# EasyEDA Pro project ProProject_Quantum Mega_v0.2_2024-08-26.epro, schematic Main
Board Name: MainBoard; Create Date: 2024-04-19; Page Name: P1; Project Name: Quantum Mega; Schematic Name: Main; Update Date: 2024-08-20; Company: EasyEDA.com; Drawn: EasyEDA; Page Size: A4; Part Number: JLCPCB-002; Reviewed: EasyEDA; Version: V0.1
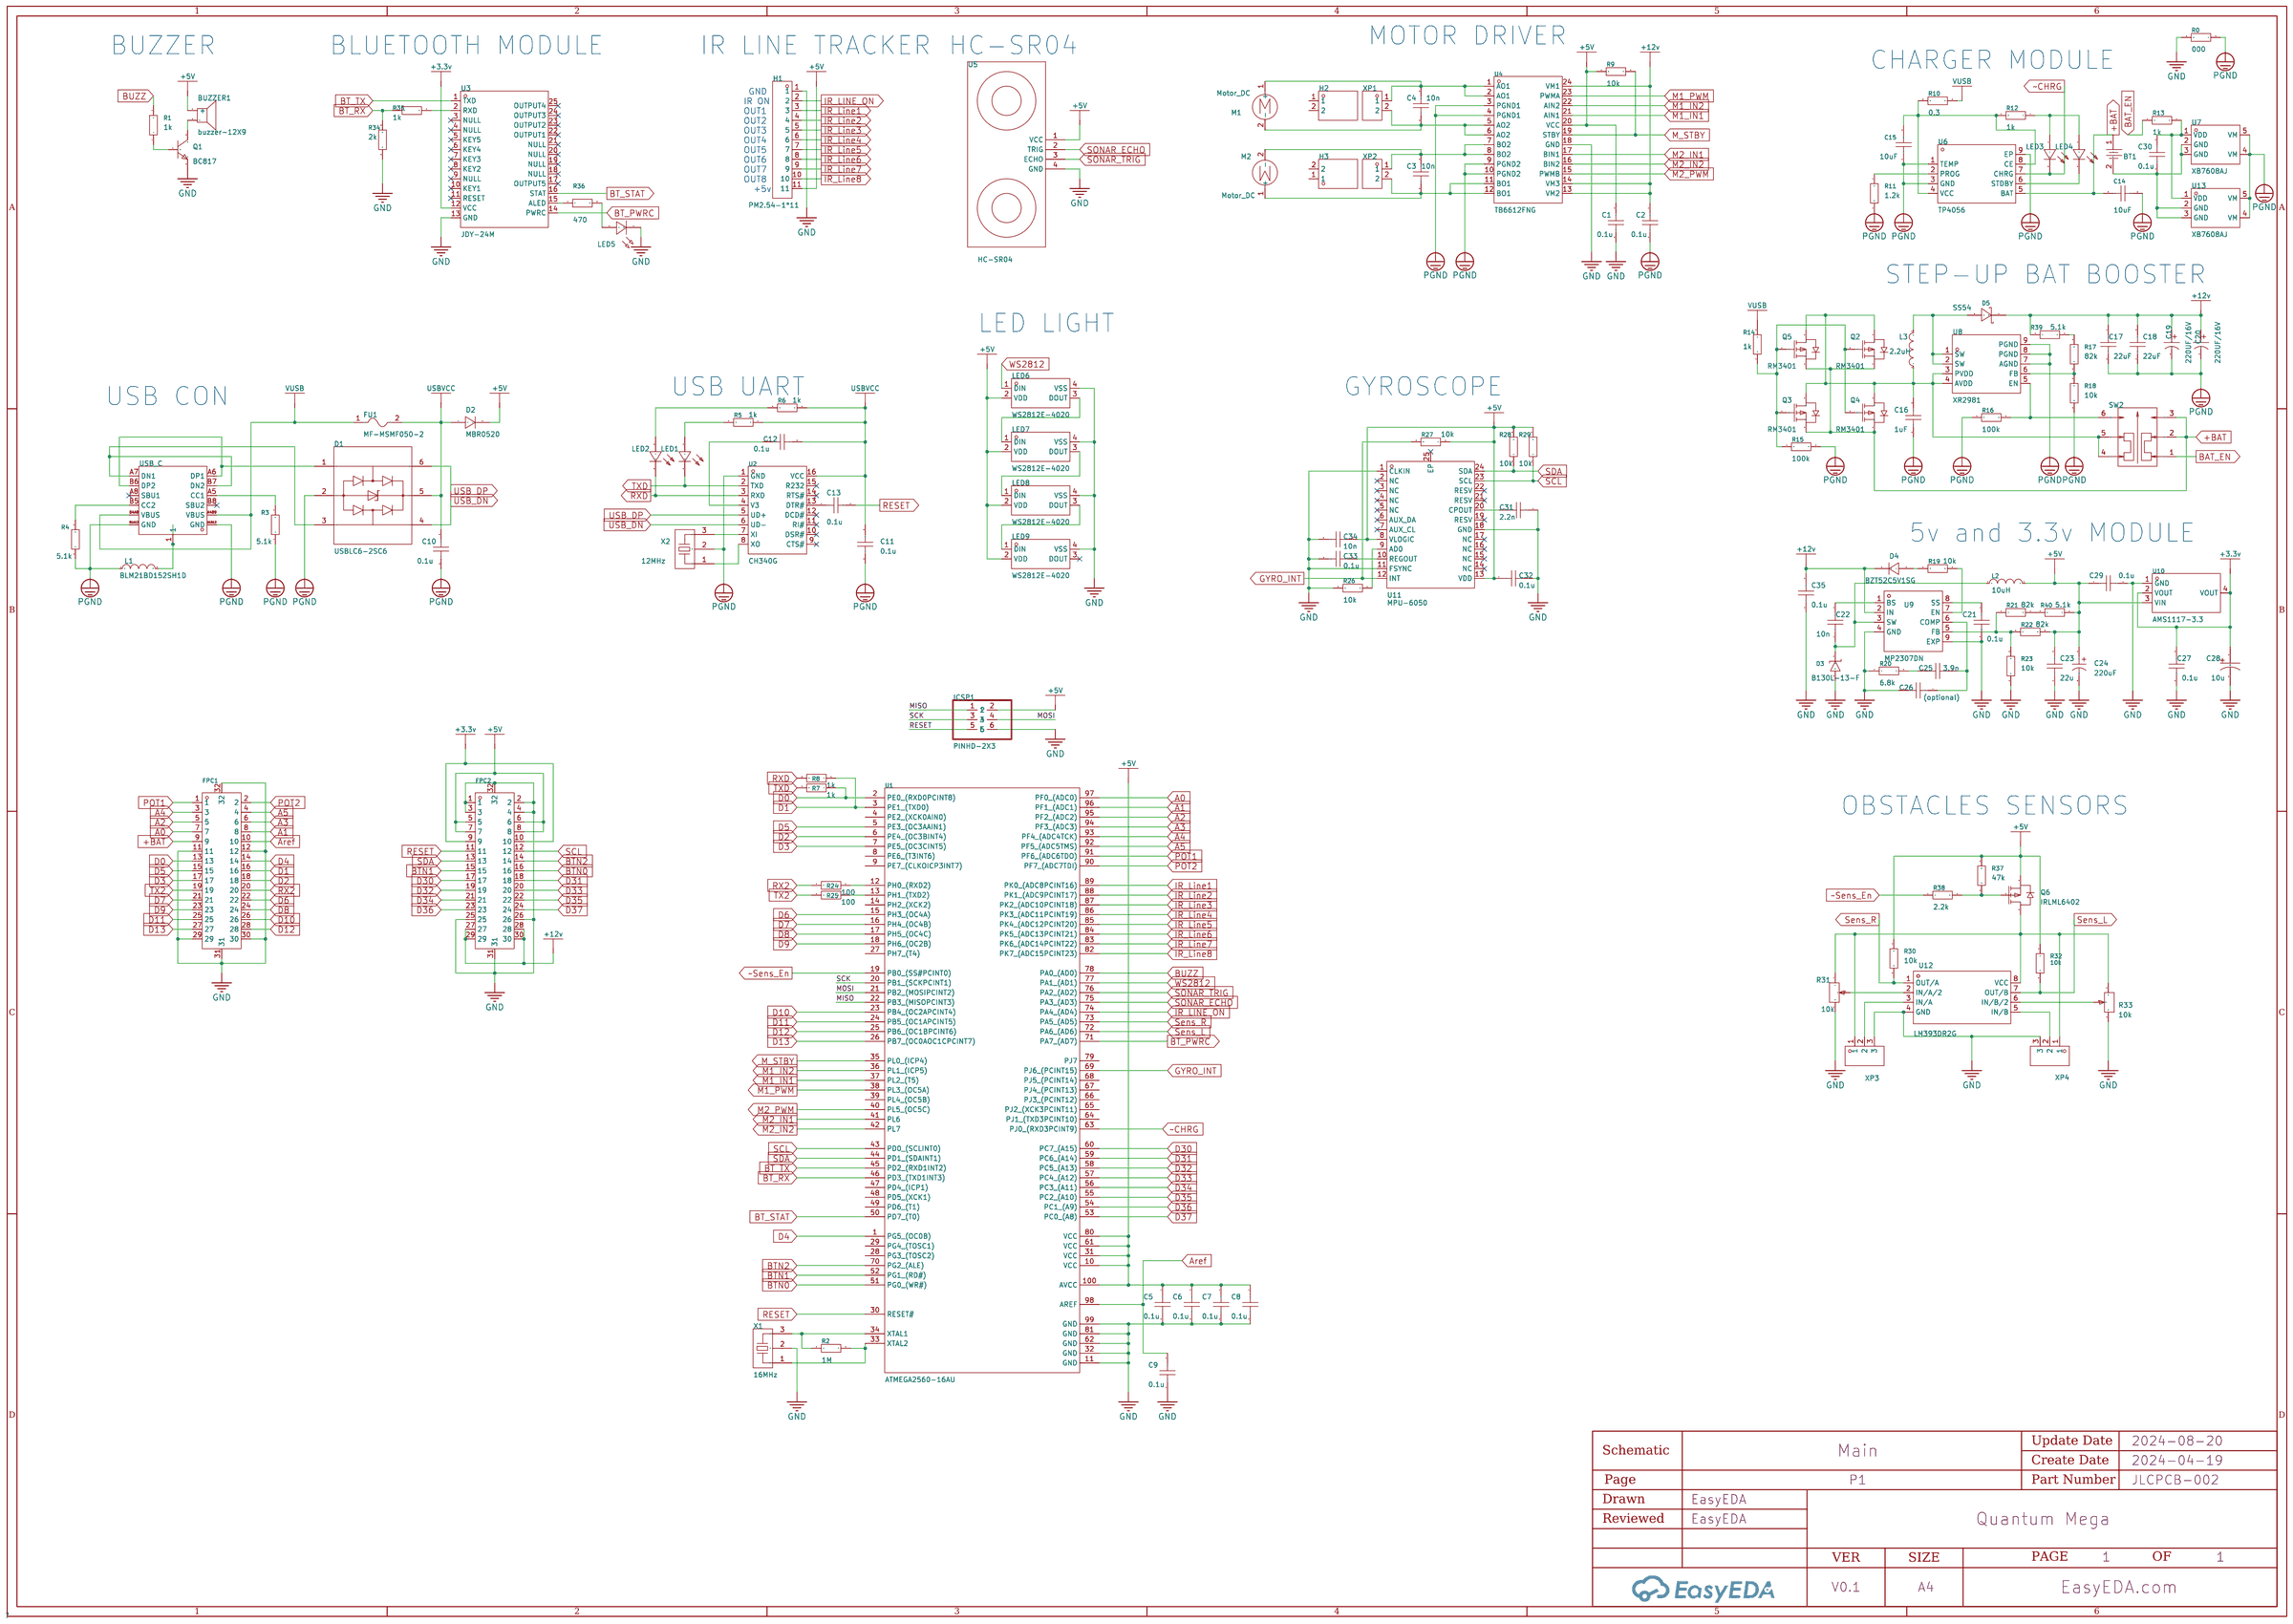
[diagram p0: schematic sheet]

## Parts
BT1  BH-18650-A5BJ001  [BAT-TH_18650-A5BJ001]
BUZZER1  buzzer-12X9  [BUZ-TH_BD12.0-P7.60-D0.6-FD]
C1  0.1u  [C0805]
C2  0.1u  [C0805]
C3  10n  [R0805]
C4  10n  [R0805]
C5  0.1u  [C0805]
C6  0.1u  [C0805]
C7  0.1u  [C0805]
C8  0.1u  [C0805]
C9  0.1u  [C0805]
C10  0.1u  [C0805]
C11  0.1u  [C0805]
C12  0.1u  [C0805]
C13  0.1u  [C0805]
C14  10uF  [C1210]
C15  10uF  [C1210]
C16  1uF  [C0805]
C17  22uF  [C1812]
C18  22uF  [C1812]
C19  220UF/16V  [CAP-SMD_BD6.3-L6.6-W6.6-LS7.2-FD]
C20  220UF/16V  [CAP-SMD_BD6.3-L6.6-W6.6-LS7.2-FD]
C21  0.1u  [C0805]
C22  10n  [C0805]
C23  22u  [C1812]
C24  220uF  [CAP-SMD_BD6.3-L6.6-W6.6-LS7.2-FD]
C25  3.9n  [C0805]
C26  (optional)  [C0805]
C27  0.1u  [C0805]
C28  10u  [CAP-SMD_BD4.0-L4.3-W4.3-LS5.3-FD]
C29  0.1u  [C0805]
C30  0.1u  [C0805]
C31  2.2n  [C0805]
C32  0.1u  [C0805]
C33  0.1u  [C0805]
C34  10n  [C0805]
C35  0.1u  [C0805]
D1  USBLC6-2SC6  [SOT-23-6_L2.9-W1.6-P0.95-LS2.8-BL]
D2  MBR0520  [SOD-123_L2.7-W1.6-LS3.7-FD]
D3  B130L-13-F  [SMA_L4.4-W2.6-LS5.0-RD]
D4  BZT52C5V1SG  [SOD-323_L1.7-W1.3-LS2.7-RD]
D5  SS54  [SMC_L6.9-W5.9-LS7.9-RD]
FPC1  FFC05012-30SSA124W5M  [FPC-SMD_FFC05012-30SSA124W5M]
FPC2  FFC05012-30SSA124W5M  [FPC-SMD_FFC05012-30SSA124W5M]
FU1  MF-MSMF050-2  [F1812]
H1  PM2.54-1*11  [HDR-TH_11P-P2.54-V-F]
H2  A2541HWR-2P  [HDR-TH_2P-P2.54-H-W8.7_A2541HWR-2P]
H3  A2541HWR-2P  [HDR-TH_2P-P2.54-H-W8.7_A2541HWR-2P]
ICSP1  3x2M  [2X03]
L1  BLM21BD152SH1D  [L0805]
L2  10uH  [IND-SMD_L7.2-W6.6_GPSR07X0]
L3  2.2uH  [IND-SMD_L10.5-W10.0]
LED1  Tx  [LED0805-R-RD_GREEN]
LED2  Rx  [LED0805-R-RD_GREEN]
LED3  CHRG  [LED0805-R-RD_GREEN]
LED4  STBY  [LED0805-R-RD_GREEN]
LED5  BT  [LED0805-RD_GREEN]
LED6  WS2812E-4020  [LED-SMD_4P-L4.0-W1.7-R]
LED7  WS2812E-4020  [LED-SMD_4P-L4.0-W1.7-R]
LED8  WS2812E-4020  [LED-SMD_4P-L4.0-W1.7-R]
LED9  WS2812E-4020  [LED-SMD_4P-L4.0-W1.7-R]
M1  Motor_DC  [N20_DC_MOTOR 3D]
M2  Motor_DC  [N20_DC_MOTOR 3D]
Q1  BC817  [SOT-23(SOT-23-3)]
Q2  RM3401  [SOT-23-3_L2.9-W1.3-P1.90-LS2.8-BR]
Q3  RM3401  [SOT-23-3_L2.9-W1.3-P1.90-LS2.8-BR]
Q4  RM3401  [SOT-23-3_L2.9-W1.3-P1.90-LS2.8-BR]
Q5  RM3401  [SOT-23-3_L2.9-W1.3-P1.90-LS2.8-BR]
Q6  IRLML6402  [SOT-23-3_L2.9-W1.3-P1.90-LS2.4-BR]
R0  000  [R0805]
R1  1k  [R0805]
R2  1M  [R0805]
R3  5.1k  [R0805]
R4  5.1k  [R0805]
R5  1k  [R0805]
R6  1k  [R0805]
R7  1k  [R0805]
R8  1k  [R0805]
R9  10k  [R0805]
R10  0.3  [R0805]
R11  1.2k  [R0805]
R12  1k  [R0805]
R13  1k  [R0805]
R14  1k  [R0805]
R15  100k  [R0805]
R16  100k  [R0805]
R17  82k  [R0805]
R18  10k  [R0805]
R19  10k  [R0805]
R20  6.8k  [R0805]
R21  82k  [R0805]
R22  82k  [R0805]
R23  10k  [R0805]
R24  100  [R0805]
R25  100  [R0805]
R26  10k  [R0805]
R27  10k  [R0805]
R28  10k  [R0805]
R29  10k  [R0805]
R30  10k  [R0805]
R31  10k  [RES-ADJ-SMD_RM065-V1]
R32  10k  [R0805]
R33  10k  [RES-ADJ-SMD_RM065-V1]
R34  2k  [R0805]
R35  1k  [R0805]
R36  470  [R0805]
R37  47k  [R0805]
R38  2.2k  [R0805]
R39  5.1k  [R0805]
R40  5.1k  [R0805]
SW2  PWR  [SW-SMD_NIDEC_CL-SB-22B-XX]
U1  ATMEGA2560-16AU  [TQFP-100_L14.0-W14.0-P0.50-LS16.0-BL]
U2  CH340G  [SOIC-16_L9.9-W3.9-P1.27-LS6.0-BL]
U3  JDY-24M  [BULETM-SMD_JDY-24M]
U4  TB6612FNG  [SSOP-24_L8.4-W5.8-P0.65-LS7.8-BL]
U5  HC-SR04  [ULTRASONIC-HC-SR04#V]
U6  TP4056  [ESOP-8_L4.9-W3.9-P1.27-LS6.0-BL-EP]
U7  XB7608AJ  [CPC-5_L2.6-W2.6-P0.53-LS4.0-BL]
U8  XR2981  [SO-8_L4.9-W3.9-P1.27-LS6.0-BL-EP]
U9  MP2307DN  [SOP-8_L4.9-W3.9-P1.27-LS6.0-BL-EP]
U10  AMS1117-3.3  [SOT-223-3_L6.5-W3.4-P2.30-LS7.0-BR]
U11  MPU-6050  [QFN-24_L4.0-W4.0-P0.50-BL-EP2.7]
U12  LM393DR2G  [SOIC-8_L5.0-W4.0-P1.27-LS6.0-BL]
U13  XB7608AJ  [CPC-5_L2.6-W2.6-P0.53-LS4.0-BL]
USB_C  USB-C-SMD-DIP_TYPEC-缩减引脚  [USB-C-SMD_C9900005364]
X1  16MHz  [OSC-SMD_3P-L3.2-W1.3-P0.95-L]
X2  12MHz  [CRYSTAL-SMD_3P-L3.2-W1.3-P1.2-L]
XP1  2.54-1*2  [HDR-TH_2P-P2.54-V-M]
XP2  2.54-1*2  [HDR-TH_2P-P2.54-V-M]
XP3  D32  [HDR-TH_3P-P2.54-V-M]
XP4  D32  [HDR-TH_3P-P2.54-V-M]

## Library data of the parts
BT1 = BH-18650-A5BJ001: Supplier Part: C5383220; Manufacturer: MYOUNG(美阳); Supplier Footprint: 插件; JLCPCB Part Class: Extended Part; Datasheet: https://atta.szlcsc.com/upload/public/pdf/source/20230321/F45C04DF2D4E00D187312CBE97BD9F67.pdf; Supplier: LCSC
BUZZER1 = BUZZER-12X9: Supplier Part: C9900016920; Supplier Footprint: BUZZER_SMT_9650B; Datasheet: https://atta.szlcsc.comnull; Supplier: LCSC
C1-C13 C16 C17 C21 C22 C25-C27 C29-C35 = CAP_0805: Supplier Footprint: 0805
C14 C15 = 10uF(106) 50V: Capacitance: Tolerance:±20% Tolerance:±20% Voltage Rated: Temperature Coefficient:; LCSC Part Name: 10uF ±20% 50V; Supplier Part: C18791; Manufacturer: SAMSUNG(三星); Supplier Footprint: 1210; Datasheet: https://atta.szlcsc.com/upload/public/pdf/source/20160218/1457707763339.pdf; Supplier: LCSC; Tolerance: ±20%
C18 C23 = C4532X7S2A475K230KB: Capacitance: Tolerance:±10% Tolerance:±10% Voltage Rated: Temperature Coefficient:; LCSC Part Name: 4.7uF ±10% 100V; Supplier Part: C5343513; Manufacturer: TDK; Supplier Footprint: 1812; Datasheet: https://atta.szlcsc.com/upload/public/pdf/source/20221215/52D81A5CA808B00E15B0062CF01F9008.pdf; Supplier: LCSC; Tolerance: ±10%
C19 C20 = 220UF/16V: Supplier Part: C9900025507; Supplier: LCSC
C24 = RVT220UF6.3V67RV0014: Capacitance: Tolerance:±20% Tolerance:±20% Rated Voltage: Ripple Current:69mA@120Hz Equivalent Series Resistance(ESR):- φD: L: Lifetime @ Temp:2000hrs@105℃ Operating Temperature:-55℃~+105℃ Operating Temperature:-55℃~+105℃; LCSC Part Name: 220uF ±20% 6.3V; Supplier Part: C2895278; Manufacturer: KNSCHA(科尼盛); Supplier Footprint: SMD,D6.3xL5.4mm; JLCPCB Part Class: Extended Part; Datasheet: https://atta.szlcsc.com/upload/public/pdf/source/20210913/890E4661012CCEBB9DDD97A723250D28.pdf; Supplier: LCSC; Tolerance: ±20%; Ripple Current: 69mA@120Hz; Lifetime @ Temp: 2000hrs@105℃; Operating Temperature: -55℃~+105℃
C28 = CAP-SMD 4*5 10uF ±10% 16V: Supplier Part: C9900020910; Supplier: LCSC
D1 = USBLC6-2SC6: Reverse Stand-Off Voltage (Vrwm):5V Maximum Clamping Voltage:20V Peak Pulse Current (Ipp)@10/1000us:5A Breakdown Voltage:6V Type:ESD; LCSC Part Name: ESD二极管 USBLC6-2SC6; Supplier Part: C323793; Supplier Footprint: SOT-23-6; JLCPCB Part Class: Extended Part; Datasheet: https://atta.szlcsc.com/upload/public/pdf/source/20181029/C323793_48F7908330A3F84485333C8DC43F9E49.pdf; Supplier: LCSC; Reverse Stand-Off Voltage (Vrwm): 5V; Maximum Clamping Voltage: 20V; Peak Pulse Current (Ipp)@10/1000us: 5A; Breakdown Voltage: 6V; Type: ESD
D2 = MBR0520: Supplier Part: C9900003957; Supplier Footprint: SMD; Supplier: LCSC
D3 = B130L-13-F: Forward Voltage (Vf@If):410mV@1A Reverse Voltage (Vr):30V Average Rectified Current (Io):1A Reverse Leakage Current (Ir):1mA@30V; LCSC Part Name: 电压:30V 电流:1A; Supplier Part: C134425; Manufacturer: DIODES(美台); Supplier Footprint: SMA(DO-214AC); JLCPCB Part Class: Extended Part; Datasheet: https://atta.szlcsc.com/upload/public/pdf/source/20171023/C134425_15087453460171052520.pdf; Supplier: LCSC; Forward Voltage (Vf@If): 410mV@1A; Reverse Voltage (Vr): 30V; Average Rectified Current (Io): 1A; Reverse Leakage Current (Ir): 1mA@30V
D4 = BZT52C5V1SG: Diode Configuration:Single Zener Voltage (Nom):5.1V Reverse Leakage Current (Ir):2uA@2V Zener Voltage (Range):4.8V~5.4V Zener Voltage (Range):4.8V~5.4V Power Dissipation:200mW Zener Impedance (Zzt):60Ω Tolerance:- Tolerance:-; Supplier Part: C380915; Manufacturer: 银河微电子; Supplier Footprint: SOD-323; JLCPCB Part Class: Extended Part; Datasheet: https://atta.szlcsc.com/upload/public/pdf/source/20190329/C380915_020C618AABE0118D1D286643A4AEE66A.pdf; Supplier: LCSC; Diode Configuration: Single; Zener Voltage (Nom): 5.1V; Reverse Leakage Current (Ir): 2uA@2V; Zener Voltage (Range): 4.8V~5.4V; Power Dissipation: 200mW; Zener Impedance (Zzt): 60Ω
D5 = SS54_C5161913: Supplier Part: C5161913; Manufacturer: ZHIDE(志得); Supplier Footprint: SMC; Datasheet: https://atta.szlcsc.com/upload/public/pdf/source/20221010/22BE397587DAF4D48DAC802777F26F98.pdf; Supplier: LCSC
FPC1 FPC2 = FFC05012-30SSA124W5M: Locking Feature:抽屉式 Contact Type:单侧触点/Vertical Number of Contacts:30P Pitch:0.5mm Mounting Type:Brick nogging FFC, FCB Thickness:0.3mm FFC, FCB Thickness:0.3mm Height Above Board:- Operating Temperature Range:-40℃~+85℃ Operating Temperature Range:-40℃~+85; LCSC Part Name: 间距:0.5mm P数:30P 抽屉式 单侧触点/垂直; Supplier Part: C2834153; Manufacturer: TXGA(特思嘉); Supplier Footprint: SMD,P=0.5mm(交错脚); JLCPCB Part Class: Extended Part; Datasheet: https://atta.szlcsc.com/upload/public/pdf/source/20210517/C2834153_A4D413E3C8B5AC462050F50D944F5EA0.pdf; Supplier: LCSC; Locking Feature: 抽屉式; Contact Type: 单侧触点/Vertical; Number of Contacts: 30P; Pitch: 0.5mm; Mounting Type: Brick nogging; FFC, FCB Thickness: 0.3mm; Operating Temperature Range: -40℃~+85℃
FU1 = MF-MSMF050-2: Operating Voltage (Max):15V Current Rating (Max):100A Hold Current:500mA Trip Current:1A Resistance - Initial (Ri) (Min):150mΩ Resistance - Post Trip (R1) (Max):1Ω Maximum Time to Trip:150ms Operating Temperature:-40℃~+85℃ Operating Temperature:-40℃~+85℃; LCSC Part Name: 15V 500mA 1812自恢复; Supplier Part: C17313; Manufacturer: BOURNS; Supplier Footprint: 1812; JLCPCB Part Class: Extended Part; Datasheet: https://atta.szlcsc.com/upload/public/pdf/source/20161125/1480068354310.pdf; Supplier: LCSC; Operating Voltage (Max): 15V; Current Rating (Max): 100A; Hold Current: 500mA; Trip Current: 1A; Resistance - Initial (Ri) (Min): 150mΩ; Resistance - Post Trip (R1) (Max): 1Ω; Maximum Time to Trip: 150ms; Operating Temperature: -40℃~+85℃
H1 = PM2.54-1*11: Holes Structure:1x11P Pitch:2.54mm Number of Rows:Plugin Contact Plating:Gold; LCSC Part Name: 1x11P 间距:2.54mm; Supplier Part: C5371988; Manufacturer: ZHOURI(洲日); Supplier Footprint: 插件,P=2.54mm; JLCPCB Part Class: Extended Part; Supplier: LCSC; Holes Structure: 1x11P; Pitch: 2.54mm; Number of Rows: Plugin; Contact Plating: Gold
H2 H3 = A2541HWR-2P: Holes Structure:1x2P Pitch:2.54mm Row Spacing:- Circular Hole / Square Hole:方孔 Mounting Type:Right-Angle Number of Rows:Plugin Number of Holes:2P Current Rating (Max):3A Voltage Rating (Max):250V Holes Direction:side Insulation Height:2.5mm Contact Materi; LCSC Part Name: 1x2P 间距:2.54mm 弯插; Supplier Part: C225510; Manufacturer: CJT(长江连接器); Supplier Footprint: 弯插,P=2.54mm; JLCPCB Part Class: Extended Part; Datasheet: https://atta.szlcsc.com/upload/public/pdf/source/20180724/C239359_48B1BC0CA1B4E4396A63955AAFD15564.pdf; Supplier: LCSC; Holes Structure: 1x2P; Pitch: 2.54mm; Circular Hole / Square Hole: 方孔; Mounting Type: Right-Angle; Number of Rows: Plugin; Number of Holes: 2P; Current Rating (Max): 3A; Voltage Rating (Max): 250V; Holes Direction: side; Insulation Height: 2.5mm; Contact Material: Brass; Contact Plating: Gold; Operating Temperature Range: -40℃~+105℃; PIN Length: 3.2mm
ICSP1 = Arduino_MEGA_2560-Rev3-eagle-import_PINHD-2X3
L1 = BLM21BD152SH1D: Impedance @ Frequency:1.5kΩ@100MHz Circuits:1; Supplier Part: C1235323; Manufacturer: muRata(村田); Supplier Footprint: 0805; JLCPCB Part Class: Extended Part; Supplier: LCSC; Impedance @ Frequency: 1.5kΩ@100MHz; Circuits: 1
L2 = CYA0630-10UH: Inductance: Tolerance:±20% Tolerance:±20% Rated Current: DC Resistance (DCR):; LCSC Part Name: 10uH ±20%; Supplier Part: C5189958; Manufacturer: SHOU HAN(首韩); Supplier Footprint: SMD,7.2x6.6mm; JLCPCB Part Class: Extended Part; Datasheet: https://atta.szlcsc.com/upload/public/pdf/source/20221010/B55E8796F05F85A38044F3826C14EFDD.pdf; Supplier: LCSC; Tolerance: ±20%
L3 = 2.2UH5A贴片电感: Supplier Part: C9900026809; Supplier Footprint: 2.2uH/5A; Supplier: LCSC
LED1-LED4 = LED_0805: Supplier Part: C9900014946; Supplier Footprint: LED0; Supplier: LCSC
LED5 = LED_0805-B: Supplier Footprint: 0805
LED6-LED9 = WS2812E-4020: Supplier Part: C5446701; Manufacturer: worldsemi; Supplier Footprint: SMD4020; JLCPCB Part Class: Extended Part; Datasheet: https://atta.szlcsc.com/upload/public/pdf/source/20230802/C0729ADAC2FEACDF29850CD4568798F9.pdf; Supplier: LCSC
M1 M2 = Motor_DC: license: https://www.gnu.org/licenses/lgpl-2.1.html
Q1 = BC817: link: https://item.szlcsc.com/9070.html; 3DModel: SOT-23-3P_L2.9-W1.3-H1.0-LS2.4-P0.95; Supplier: LCSC; Manufacturer: CJ; image: //image.lceda.cn/szlcsc/C8589.jpg; Supplier Part: C8589; JLCPCB Part Class: Extended Part
Q2-Q5 = RM3401: Type:1个PChannel Drain Source Voltage (Vdss): Continuous Drain Current (Id): Power Dissipation (Pd): Drain Source On Resistance (RDS(on)@Vgs,Id): Gate Threshold Voltage (Vgs(th)@Id):1.3V@250uA Input Capacitance (Ciss@Vds):880pF@15V Operating Temperature:-5; LCSC Part Name: 1个P沟道 耐压:30V 电流:4.2A; Supplier Part: C3289980; Manufacturer: RECTRON(丽正); Supplier Footprint: SOT-23; Datasheet: https://atta.szlcsc.com/upload/public/pdf/source/20240403/615A0FF49014754CF5DAE5883E8BCBFD.pdf; Supplier: LCSC; Type: 1个PChannel; Gate Threshold Voltage (Vgs(th)@Id): 1.3V@250uA; Input Capacitance (Ciss@Vds): 880pF@15V; Operating Temperature: -55℃~+150℃@(Tj)
Q6 = IRLML6402: LCSC Part Name: MOS管; Supplier Part: C2959853; Manufacturer: TECH PUBLIC(台舟); Supplier Footprint: SOT-23; JLCPCB Part Class: Extended Part; Datasheet: https://atta.szlcsc.com/upload/public/pdf/source/20220120/03536D8328DEC2090766B19669562DF5.pdf; Supplier: LCSC
R0-R30 R32 R34-R40 = 0805 resistor: LCSC Part Name: 12kΩ ±1% 125mW 厚膜电阻; Supplier Part: C17444; Manufacturer: UNI-ROYAL(厚声); Manufacturer Part: 0805W8F1202T5E; Supplier Footprint: 0805; JLCPCB Part Class: Basic Part; Datasheet: https://atta.szlcsc.com/upload/public/pdf/source/20200306/C422600_1E6D84923E4A46A82E41ADD87F860B5C.pdf; Supplier: LCSC; Tolerance: ±1%; Temperature Coefficient: ±100ppm/℃; Type: Thick Film Resistors; Operating Temperature Range: -55℃~+155℃
R31 R33 = RM065-501(500R): Resistance: Tolerance:±25% Tolerance:±25% Power(Watts):; LCSC Part Name: 500Ω ±25%; Supplier Part: C5205017; Manufacturer: BOCHEN(博晨); Supplier Footprint: 插件; JLCPCB Part Class: Extended Part; Datasheet: https://atta.szlcsc.com/upload/public/pdf/source/20221019/6263C46FBC7F1B66CBAADA74DC5EFAA2.pdf; Supplier: LCSC; Tolerance: ±25%
SW2 = CL-SB-22B-02: Circuit:DPDT Actuator Style:Rectangular columnar Pin Style:Gull Wing Mounting Style:Brick nogging Voltage Rating (DC):12V Operating Temperature:-40℃~+85℃ Operating Temperature:-40℃~+85℃; Supplier Part: C5573311; Manufacturer: NIDEC(尼得科); Datasheet: https://atta.szlcsc.com/upload/public/pdf/source/231023/cl-sb.pdf-55b3417ad2bcaca9f3ae11e732aa5559.pdf; Supplier: LCSC; Circuit: DPDT; Actuator Style: Rectangular columnar; Pin Style: Gull Wing; Mounting Style: Brick nogging; Voltage Rating (DC): 12V; Operating Temperature: -40℃~+85℃
U1 = ATMEGA2560-16AU: CPU Core:AVR Program Storage Size:256KB RAM Size:8KB GPIO Ports Number:86 Operating Voltage Range:4.5V~5.5V Operating Voltage Range:4.5V~5.5V CPU Maximum Speed:16MHz Program Memory Type:FLASH EEPROM:4KB Operating Temperature Range:-40℃~+85℃ Operating Temp; LCSC Part Name: ATMEGA2560-16AU MSL=3; Supplier Part: C22460; Manufacturer: MICROCHIP(美国微芯); Supplier Footprint: TQFP-100(14x14); JLCPCB Part Class: Extended Part; Datasheet: https://atta.szlcsc.com/upload/public/pdf/source/20180629/C184061_12C3FF49A7078B074E4E6578B2EA6640.pdf; Supplier: LCSC; CPU Core: AVR; Program Storage Size: 256KB; RAM Size: 8KB; GPIO Ports Number: 86; Operating Voltage Range: 4.5V~5.5V; CPU Maximum Speed: 16MHz; Program Memory Type: FLASH; EEPROM: 4KB; Operating Temperature Range: -40℃~+85℃; ADC (Bit): 10bit; Peripheral/Function: WDT；PWM; Watchdog: 有; Low-Voltage Detect: 有; Internal Oscillator: 有
U2 = CH340G: Applications Function:Transceiver Protocol: Supply Voltage:3.3V；5V Supply Voltage:3.3V；5V Data Rate:2Mbps; LCSC Part Name: USB转串口芯片 CH340; Supplier Part: C14267; Manufacturer: WCH(南京沁恒); Supplier Footprint: SOP-16; JLCPCB Part Class: Extended Part; Datasheet: https://atta.szlcsc.com/upload/public/pdf/source/20230530/6E401E9554E9F5311886CC8B3F89B62E.pdf; Supplier: LCSC; Applications Function: Transceiver; Supply Voltage: 3.3V；5V; Data Rate: 2Mbps
U3 = JDY-24M: Supplier Part: C9900004473; Supplier Footprint: SMD; JLCPCB Part Class: Extended Part; Supplier: LCSC
U4 = TB6612FNG(O,C,8,EL: Supplier Part: C88224; Manufacturer: TOSHIBA(东芝); Supplier Footprint: SSOP-24-208mil; JLCPCB Part Class: Extended Part; Datasheet: https://atta.szlcsc.com/upload/public/pdf/source/20171128/C141517_15118625624231147036.pdf; Supplier: LCSC
U5 = ULTRASONIC-HC-SR04_#V
U6 = TP4056: Supplier Part: C9900002169; Supplier Footprint: ESOP-8; Supplier: LCSC
U7 U13 = XB7608AJ: Supplier Part: C2681921; Manufacturer: xysemi(赛芯微); Supplier Footprint: CPC-5; JLCPCB Part Class: Extended Part; Datasheet: https://atta.szlcsc.com/upload/public/pdf/source/20201230/C2681921_63F43FD1A79E48A5DEB3B0D5E2CF4C87.pdf; Supplier: LCSC
U8 = XR2981: Supplier Part: C2687446; Supplier Footprint: MSOP-8-EP(3.9x4.9x1.27); JLCPCB Part Class: Extended Part; Supplier: LCSC
U9 = MP2307DN-LF-Z: Function:Step-down type Output Type:Adjustable Input Voltage:4.75V~23V Input Voltage:4.75V~23V Output Voltage:0.925V~20V Output Voltage:0.925V~20V Output Current (Max):3A Switching Frequency:340kHz Operating Temperature:-40℃~+85℃@(TA) Operating Temperatur; Supplier Part: C18921; Supplier Footprint: SOP-8-EP-150mil; JLCPCB Part Class: Extended Part; Supplier: LCSC; Function: Step-down type; Output Type: Adjustable; Input Voltage: 4.75V~23V; Output Voltage: 0.925V~20V; Output Current (Max): 3A; Switching Frequency: 340kHz; Operating Temperature: -40℃~+85℃@(TA); Synchronous Rectification: Yes; Number of Outputs: 1; Topology: Step-down; Switch tube (built-in/external): 内置
U10 = AMS1117-3.3_C6186: Output Type: Maximum Input Voltage:- Output Voltage:3.3V Output Voltage:3.3V MAX Output Current:1A Power Supply Rejection Ratio (PSRR):72dB@(120Hz) Dropout Voltage:1.3V@(800mA) standby current:- Noise:- Feature:- Operating Temperature:- Operating Temperat; LCSC Part Name: 输出3.3V 1A; Supplier Part: C6186; Manufacturer: AMS; Supplier Footprint: SOT-223-3; JLCPCB Part Class: Basic Part; Datasheet: https://atta.szlcsc.com/upload/public/pdf/source/20180727/C6186_7A095716F0823C02F1997A905E26C086.pdf; Supplier: LCSC; Output Voltage: 3.3V; MAX Output Current: 1A; Power Supply Rejection Ratio (PSRR): 72dB@(120Hz); Dropout Voltage: 1.3V@(800mA); Output Polarity: Positive electrode; Number of Outputs: 1
U11 = MPU-6050: Sensor Type:加速度计陀螺仪 Operating Temperature:-40℃~+85℃ Operating Temperature:-40℃~+85℃; Supplier Part: C24112; Manufacturer: TDK InvenSense(应美盛); Supplier Footprint: QFN-24-EP(4x4); JLCPCB Part Class: Extended Part; Datasheet: https://atta.szlcsc.com/upload/public/pdf/source/20140425/1457707046159.pdf; Supplier: LCSC; Sensor Type: 加速度计陀螺仪; Operating Temperature: -40℃~+85℃
U12 = LM393DR2G: Input Offset Voltage (Vos):5mV Input Bias Current (Ib):250nA Input Hysteresis Voltage (Vhys):- Common Mode Rejection Ratio (CMRR):- Supply Voltage:1V~18V；2V~36V Supply Voltage:1V~18V；2V~36V Output Type:开集 Output Mode:- Supply Current:2.5mA Operating Tempe; LCSC Part Name: 比较器，双，低偏移电压; Supplier Part: C7955; Manufacturer: onsemi(安森美); Supplier Footprint: SOIC-8; JLCPCB Part Class: Basic Part; Datasheet: https://atta.szlcsc.com/upload/public/pdf/source/20140815/1457707223499.pdf; Supplier: LCSC; Input Offset Voltage (Vos): 5mV; Input Bias Current (Ib): 250nA; Supply Voltage: 1V~18V；2V~36V; Output Type: 开集; Supply Current: 2.5mA; Operating Temperature: 0℃~+70℃
USB_C = USB-C-SMD-DIP_TYPEC-缩减引脚: Supplier Part: C9900005364; Supplier Footprint: USB-C-SMD-DIP; Supplier: LCSC
X1 = CSTCE16M0V53-R0: Frequency: Built-in Load Capacitance: Resonant Impedance: Operating Temperature:-20℃~+80℃ Operating Temperature:-20℃~+80℃; LCSC Part Name: 16MHz ±0.5% 内置负载电容:15pF; Supplier Part: C32180; Manufacturer: muRata(村田); Supplier Footprint: SMD3213-3P; JLCPCB Part Class: Extended Part; Datasheet: https://atta.szlcsc.com/upload/public/pdf/source/20190918/C363966_9B0AD0E91EFDC171DB7BF0EEA53BA277.pdf; Supplier: LCSC; Operating Temperature: -20℃~+80℃
X2 = CSTCE12M0G52-R0: Frequency: Built-in Load Capacitance: Resonant Impedance:- Operating Temperature:-20℃~+80℃ Operating Temperature:-20℃~+80℃; LCSC Part Name: 12M ±0.5% 10pF 即将停产 即将停产; Supplier Part: C91580; Manufacturer: muRata(村田); Supplier Footprint: SMD3213-3P; Datasheet: https://atta.szlcsc.com/upload/public/pdf/source/20161226/1482720169997.pdf; Supplier: LCSC; Operating Temperature: -20℃~+80℃
XP1 XP2 = 2.54-1*2: Pin Structure:1x2P Pitch:2.54mm Number of Rows:Plugin Number of Pins:2P Contact Plating:Gold; LCSC Part Name: 停产; Supplier Part: C5116481; Manufacturer: ZHOURI(洲日); Supplier Footprint: 插件,P=2.54mm; JLCPCB Part Class: Extended Part; Datasheet: https://atta.szlcsc.com/upload/public/pdf/source/20220729/DF18AADA08AA3A4F1D3B0508BB8F7248.pdf; Supplier: LCSC; Pin Structure: 1x2P; Pitch: 2.54mm; Number of Rows: Plugin; Number of Pins: 2P; Contact Plating: Gold
XP3 XP4 = 5-146277-3: Pitch:2.54mm Circluar Pins/Square Pins:Square Pins Mounting Type:Straight Number of Rows:Plugin Number of Pins:3P Current Rating (Max):3A Voltage Rating (Max):- Length of Mating Pin:8.08mm Insulation Height:2.29mm Length of End Connection Pin:3.18mm Conta; LCSC Part Name: 间距:2.54mm 直插 方针; Supplier Part: C3327863; Manufacturer: TE Connectivity(泰科电子); Supplier Footprint: 插件,P=2.54mm; JLCPCB Part Class: Extended Part; Datasheet: https://atta.szlcsc.com/upload/public/pdf/source/20240320/B5A87472A4F0F2898233D24AD0789840.pdf; Supplier: LCSC; Pitch: 2.54mm; Circluar Pins/Square Pins: Square Pins; Mounting Type: Straight; Number of Rows: Plugin; Number of Pins: 3P; Current Rating (Max): 3A; Length of Mating Pin: 8.08mm; Insulation Height: 2.29mm; Length of End Connection Pin: 3.18mm; Contact Plating: Tin; Operating Temperature Range: -65℃~+105℃; Color: Black

## Nets
+3.3v: C27.1 C28.1 FPC2.9 FPC2.10 U3.12(VCC) U10.2(VOUT) U10.4(VOUT)
+5V: BUZZER1.1(+) C1.1 C5.1 C6.1 C7.1 C8.1 C23.2 C24.1 C29.1 C32.1 C34.1 D2.2(K) FPC2.5 FPC2.6 FPC2.7 FPC2.8 H1.11 ICSP1.2 L2.2 LED6.2(VDD) LED7.2(VDD) LED8.2(VDD) LED9.2(VDD) Q6.2(S) R9.1 R22.2 R27.1 R28.2 R29.2 R30.1 R32.1 R37.1 R40.1 U1.10(VCC) U1.31(VCC) U1.61(VCC) U1.80(VCC) U1.100(AVCC) U4.20(VCC) U5.1(VCC) U10.3(VIN) U11.8(VLOGIC) U11.13(VDD)
+12v: C2.1 C17.1 C18.2 C19.1 C20.1 C35.2 D4.1(C) D5.1(C) FPC2.27 FPC2.28 FPC2.29 FPC2.30 R39.1 U4.13(VM2) U4.14(VM3) U4.24(VM1) U9.2(IN)
GND: C1.2 C5.2 C6.2 C7.2 C8.2 C9.2 C21.2 C23.1 C24.2 C26.2 C27.2 C28.2 C29.2 C31.2 C32.2 C33.2 C34.2 C35.1 D3.2 FPC1.11 FPC1.12 FPC1.29 FPC1.30 FPC1.31 FPC1.32 FPC2.1 FPC2.2 FPC2.3 FPC2.4 FPC2.25 FPC2.26 FPC2.31 FPC2.32 H1.1 ICSP1.6 LED5.1(C) LED6.4(VSS) LED7.4(VSS) LED8.4(VSS) LED9.4(VSS) Q1.2(E) R0.2 R20.1 R23.1 R26.2 R31.3 R33.3 R34.1 U1.11(GND) U1.32(GND) U1.62(GND) U1.81(GND) U1.99(GND) U3.13(GND) U4.18(GND) U5.4(GND) U9.4(GND) U9.9(EXP) U10.1(GND) U11.1(CLKIN) U11.11(FSYNC) U11.18(GND) U12.4(GND) X1.2 XP3.3 XP4.3
PGND: C2.2 C10.2 C11.1 C14.1 C15.1 C16.2 C17.2 C18.1 C19.2 C20.2 D1.2 L1.1 R0.1 R3.1 R4.1 R11.2 R15.2 R16.1 R18.2 U2.1(GND) U4.3(PGND1) U4.4(PGND1) U4.9(PGND2) U4.10(PGND2) U6.1(TEMP) U6.3(GND) U6.9(EP) U7.4(VM) U7.5(VM) U8.7(AGND) U8.8(PGND) U8.9(PGND) U13.4(VM) U13.5(VM) USB_C.A1B12(GND) USB_C.B1A12(GND) X2.2
+BAT: BT1.1 C14.2 FPC1.9 Q2.2(S) Q3.2(S) Q4.2(S) Q5.2(S) SW2.2 SW2.3 U6.5(BAT)
A0: FPC1.7 U1.97(PF0 (ADC0))
A1: FPC1.8 U1.96(PF1 (ADC1))
A2: FPC1.5 U1.95(PF2 (ADC2))
A3: FPC1.6 U1.94(PF3 (ADC3))
A4: FPC1.3 U1.93(PF4 (ADC4TCK))
A5: FPC1.4 U1.92(PF5 (ADC5TMS))
Aref: C9.1 FPC1.10 U1.98(AREF)
BAT_EN: R13.2 SW2.1
BT_PWRC: U1.71(PA7 (AD7)) U3.14(PWRC)
BT_RX: R34.2 R35.1 U1.46(PD3 (TXD1INT3))
BT_STAT: U1.50(PD7 (T0)) U3.16(STAT)
BT_TX: U1.45(PD2 (RXD1INT2)) U3.1(TXD)
BTN0: FPC2.16 U1.51(PG0 (WR#))
BTN1: FPC2.15 U1.52(PG1 (RD#))
BTN2: FPC2.14 U1.70(PG2 (ALE))
BUZZ: R1.2 U1.78(PA0 (AD0))
D0: FPC1.13 R7.1 U1.2(PE0 (RXD0PCINT8))
D1: FPC1.16 R8.1 U1.3(PE1 (TXD0))
D2: FPC1.18 U1.6(PE4 (OC3BINT4))
D3: FPC1.17 U1.7(PE5 (OC3CINT5))
D4: FPC1.14 U1.1(PG5 (OC0B))
D5: FPC1.15 U1.5(PE3 (OC3AAIN1))
D6: FPC1.22 U1.15(PH3 (OC4A))
D7: FPC1.21 U1.16(PH4 (OC4B))
D8: FPC1.24 U1.17(PH5 (OC4C))
D9: FPC1.23 U1.18(PH6 (OC2B))
D10: FPC1.26 U1.23(PB4 (OC2APCINT4))
D11: FPC1.25 U1.24(PB5 (OC1APCINT5))
D12: FPC1.28 U1.25(PB6 (OC1BPCINT6))
D13: FPC1.27 U1.26(PB7 (OC0AOC1CPCINT7))
D30: FPC2.17 U1.60(PC7 (A15))
D31: FPC2.18 U1.59(PC6 (A14))
D32: FPC2.19 U1.58(PC5 (A13))
D33: FPC2.20 U1.57(PC4 (A12))
D34: FPC2.21 U1.56(PC3 (A11))
D35: FPC2.22 U1.55(PC2 (A10))
D36: FPC2.23 U1.54(PC1 (A9))
D37: FPC2.24 U1.53(PC0 (A8))
GYRO_INT: R27.2 U1.69(PJ6 (PCINT15)) U11.12(INT)
IR_Line1: H1.3 U1.89(PK0 (ADC8PCINT16))
IR_Line2: H1.4 U1.88(PK1 (ADC9PCINT17))
IR_Line3: H1.5 U1.87(PK2 (ADC10PCINT18))
IR_Line4: H1.6 U1.86(PK3 (ADC11PCINT19))
IR_Line5: H1.7 U1.85(PK4 (ADC12PCINT20))
IR_Line6: H1.8 U1.84(PK5 (ADC13PCINT21))
IR_Line7: H1.9 U1.83(PK6 (ADC14PCINT22))
IR_Line8: H1.10 U1.82(PK7 (ADC15PCINT23))
IR_LINE_ON: H1.2 U1.74(PA4 (AD4))
M1_IN1: U1.37(PL2 (T5)) U4.21(AIN1)
M1_IN2: U1.36(PL1 (ICP5)) U4.22(AIN2)
M1_PWM: U1.38(PL3 (OC5A)) U4.23(PWMA)
M2_IN1: U1.41(PL6) U4.17(BIN1)
M2_IN2: U1.42(PL7) U4.16(BIN2)
M2_PWM: U1.40(PL5 (OC5C)) U4.15(PWMB)
M_STBY: R9.2 U1.35(PL0 (ICP4)) U4.19(STBY)
MISO: ICSP1.1 U1.22(PB3 (MISOPCINT3))
MOSI: ICSP1.4 U1.21(PB2 (MOSIPCINT2))
POT1: FPC1.1 U1.91(PF6 (ADC6TDO))
POT2: FPC1.2 U1.90(PF7 (ADC7TDI))
RESET: C13.2 FPC2.11 ICSP1.5 U1.30(RESET#)
RX2: FPC1.20 R24.2
RXD: LED2.2(C) R8.2 U2.3(RXD)
SCK: ICSP1.3 U1.20(PB1 (SCKPCINT1))
SCL: FPC2.12 R29.1 U1.43(PD0 (SCLINT0)) U11.23(SCL)
SDA: FPC2.13 R28.1 U1.44(PD1 (SDAINT1)) U11.24(SDA)
Sens_L: R32.2 U1.72(PA6 (AD6)) U12.7(OUT/B)
Sens_R: R30.2 U1.73(PA5 (AD5)) U12.1(OUT/A)
SONAR_ECHO: U1.75(PA3 (AD3)) U5.2(TRIG)
SONAR_TRIG: U1.76(PA2 (AD2)) U5.3(ECHO)
TX2: FPC1.19 R25.2
TXD: LED1.2(C) R7.2 U2.2(TXD)
USB_DN: D1.4 U2.6(UD-)
USB_DP: D1.6 U2.5(UD+)
USBVCC: C10.1 C11.2 C12.2 D1.5 D2.1(A) FU1.2 R5.1 R6.1 U2.16(VCC)
VUSB: FU1.1 R10.1 R14.2 USB_C.A4B9(VBUS) USB_C.B4A9(VBUS)
WS2812: LED6.1(DIN) U1.77(PA1 (AD1))
~CHRG: LED3.2(C) U1.63(PJ0 (RXD3PCINT9)) U6.7(CHRG)
~Sens_En: R38.1 U1.19(PB0 (SS#PCINT0))
$1N3375: BUZZER1.2 Q1.3(C)
$1N3378: Q1.1(B) R1.1
$1N9699: R2.2 U1.34(XTAL1) X1.3
$1N9712: R2.1 U1.33(XTAL2) X1.1
$1N10624: L1.2 USB_C.1
$1N10918: D1.1 USB_C.A6(DP1) USB_C.B6(DP2)
$1N10981: R3.2 USB_C.A5(CC1)
$1N11074: R4.2 USB_C.B5(CC2)
$1N11370: C12.1 U2.4(V3)
$1N11559: U2.7(XI) X2.3
$1N11562: U2.8(XO) X2.1
$1N11598: C13.1 U2.13(DTR#)
$1N11886: LED1.1(A) R5.2
$1N11890: LED2.1(A) R6.2
$1N24194: LED3.1(A) LED4.1(A) R12.1
$1N24238: LED4.2(C) U6.6(STDBY)
$1N24335: R11.1 U6.2(PROG)
$1N24524: C15.2 R10.2 R12.2 U6.4(VCC) U6.8(CE)
$1N24951: D5.2(A) L3.2 U8.1(SW) U8.2(SW)
$1N25055: R17.2 R18.1 U8.6(FB)
$1N26007: R19.2 U9.7(EN)
$1N26048: C21.1 U9.8(SS)
$1N26110: C22.2 U9.1(BS)
$1N26326: C22.1 D3.1 L2.1 U9.3(SW)
$1N26586: C25.2 R20.2
$1N26616: C25.1 C26.1 U9.6(COMP)
$1N26891: R21.1 R22.1 R23.2 U9.5(FB)
$1N27650: BT1.2 C30.1 U7.2(GND) U7.3(GND) U13.2(GND) U13.3(GND)
$1N34996: R24.1 U1.12(PH0 (RXD2))
$1N34999: R25.1 U1.13(PH1 (TXD2))
$1N43117: C31.1 U11.20(CPOUT)
$1N43225: C33.1 U11.10(REGOUT)
$1N43544: R26.1 U11.9(AD0)
$1N62340: LED6.3(DOUT) LED7.1(DIN)
$1N62345: LED7.3(DOUT) LED8.1(DIN)
$1N62350: LED8.3(DOUT) LED9.1(DIN)
$1N65982: R31.2 U12.2(IN/A/2)
$1N66392: R33.2 U12.6(IN/B/2)
$1N77423: R35.2 U3.2(RXD)
$1N77517: R36.1 U3.15(ALED)
$1N77601: LED5.2(A) R36.2
$1N81153: U12.3(IN/A) XP3.2
$1N81281: U12.5(IN/B) XP4.2
$1N111714: C16.1 L3.1 Q2.3(D) Q3.3(D) Q4.3(D) Q5.3(D) SW2.4 SW2.5 U8.3(PVDD) U8.4(AVDD)
$1N115406: R16.2 SW2.6 U8.5(EN)
$1N129837: C3.1 M2.2(-) U4.7(BO2) U4.8(BO2) XP2.1
$1N129847: C3.2 M2.1(+) U4.11(BO1) U4.12(BO1) XP2.2
$1N129857: C4.2 M1.2(-) U4.5(AO2) U4.6(AO2) XP1.2
$1N129867: C4.1 M1.1(+) U4.1(AO1) U4.2(AO1) XP1.1
$1N129923: R17.1 R39.2
$1N130012: R21.2 R40.2
$1N133804: Q2.1(G) Q3.1(G) Q4.1(G) Q5.1(G) R14.1 R15.1
$1N133891: C30.2 R13.1 U7.1(VDD) U13.1(VDD)
$1N137543: D4.2(A) R19.1
$1N137599: D1.3 USB_C.A7(DN1) USB_C.B7(DN2)
$1N141417: Q6.3(D) R31.1 R33.1 U12.8(VCC) XP3.1 XP4.1
$1N141429: Q6.1(G) R37.2 R38.2

Not connected (* = marked no-connect by the designer): H2 1 2; H3 1 2; LED9 3(DOUT)*; U1 4(PE2 (XCK0AIN0)) 8(PE6 (T3INT6)) 9(PE7 (CLKOICP3INT7)) 14(PH2 (XCK2)) 27(PH7 (T4)) 28(PG3 (TOSC2)) 29(PG4 (TOSC1)) 39(PL4 (OC5B)) 47(PD4 (ICP1)) 48(PD5 (XCK1)) 49(PD6 (T1)) 64(PJ1 (TXD3PCINT10)) 65(PJ2 (XCK3PCINT11)) 66(PJ3 (PCINT12)) 67(PJ4 (PCINT13)) 68(PJ5 (PCINT14)) 79(PJ7); U2 9(CTS#)* 10(DSR#)* 11(RI#)* 12(DCD#)* 14(RTS#)* 15(R232)*; U3 3(NULL)* 4(NULL)* 5(KEY5)* 6(KEY4)* 7(KEY3)* 8(KEY2)* 9(NULL)* 10(KEY1)* 11(RESET)* 17(OUTPUT5)* 18(NULL)* 19(NULL)* 20(NULL)* 21(NULL)* 22(OUTPUT1)* 23(OUTPUT2)* 24(OUTPUT3)* 25(OUTPUT4)*; U11 2(NC)* 3(NC)* 4(NC)* 5(NC)* 6(AUX_DA)* 7(AUX_CL)* 14(NC)* 15(NC)* 16(NC)* 17(NC)* 19(RESV)* 21(RESV)* 22(RESV)* 25(EP)*; USB_C A8(SBU1)* B8(SBU2)*

## Notes on the sheet
- MOTOR DRIVER
- BUZZER
- BLUETOOTH MODULE
- IR LINE TRACKER
- HC-SR04
- CHARGER MODULE
- GND
- IR ON
- OUT1
- OUT2
- OUT3
- OUT4
- OUT5
- OUT6
- OUT7
- OUT8
- +5v
- STEP-UP BAT BOOSTER
- LED LIGHT
- USB UART
- GYROSCOPE
- USB CON
- 5v and 3.3v MODULE
- OBSTACLES SENSORS
